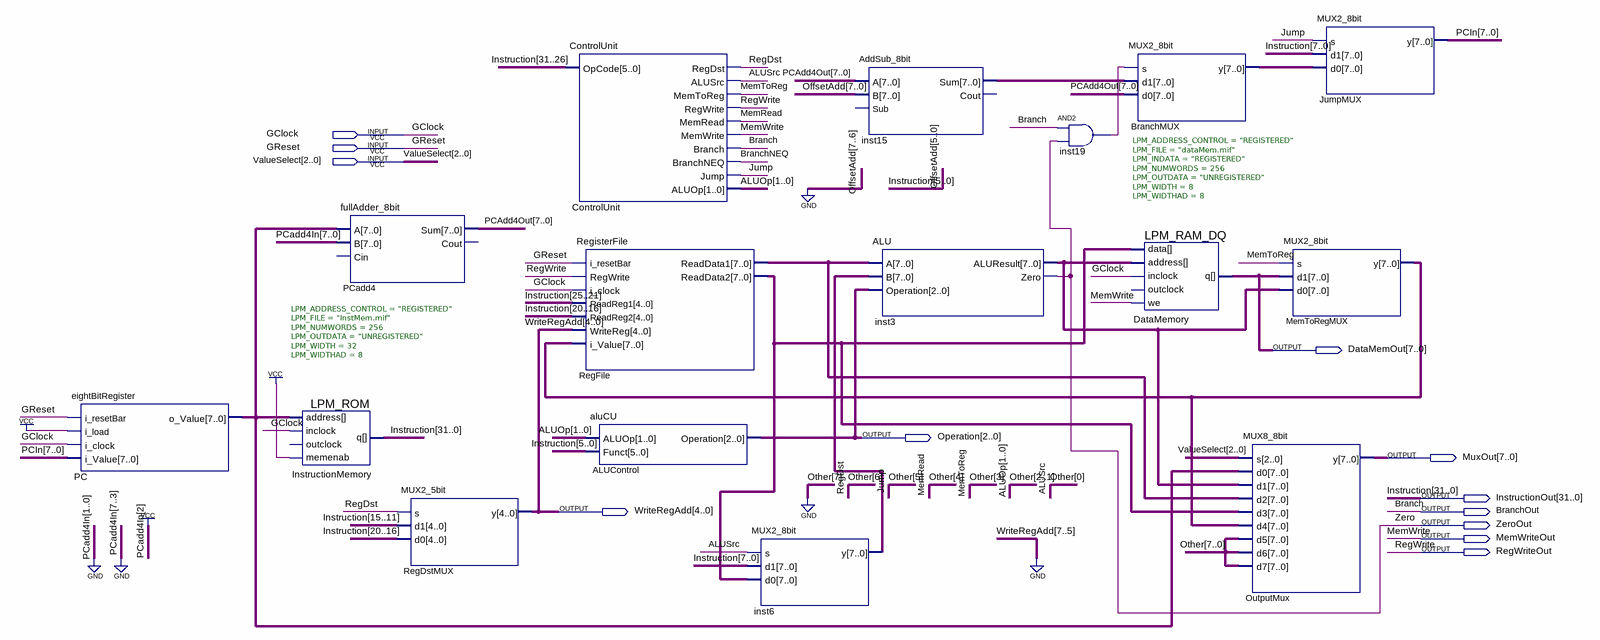
[diagram p0: schematic sheet]
// Quartus schematic singleCycleProc.bdf as structural Verilog: 16 symbols, 12 pins
module singleCycleProc (
  input  GClock,
  input  GReset,
  input  [2:0] ValueSelect,
  output [7:0] DataMemOut,
  output [2:0] Operation,
  output [7:0] MuxOut,
  output [31:0] InstructionOut,
  output [4:0] WriteRegAdd,
  output BranchOut,
  output ZeroOut,
  output MemWriteOut,
  output RegWriteOut
);

  wire ALUSrc, BranchNEQ, inst19_out, Jump, MemRead, MemToReg, RegDst;
  wire [1:0] ALUOp;
  wire [5:0] OffsetAdd;
  wire [6:0] Other;
  wire [7:0] BranchMUX_y, inst3_aluresult, inst6_y, inst15_sum, MemToRegMUX_y, PC_o_value, PCAdd4Out, PCIn,
       RegFile_readdata1, RegFile_readdata2;

  eightBitRegister PC (.i_resetBar(GReset), .i_load(1'b1), .i_clock(GClock), .i_Value(PCIn), .o_Value(PC_o_value));
  fullAdder_8bit PCadd4 (.A(PC_o_value), .B(8'b00000100), .Sum(PCAdd4Out));  // open: Cin, Cout
  LPM_ROM #(.LPM_ADDRESS_CONTROL("REGISTERED"), .LPM_FILE("InstMem.mif"), .LPM_NUMWORDS(256), .LPM_OUTDATA("UNREGISTERED"), .LPM_WIDTH(32), .LPM_WIDTHAD(8)) InstructionMemory (
    .address(PC_o_value), .inclock(GClock), .memenab(1'b1), .q(InstructionOut));  // open: outclock
  MUX2_5bit RegDstMUX (.s(RegDst), .d1(InstructionOut[15:11]), .d0(InstructionOut[20:16]), .y(WriteRegAdd));
  ControlUnit ControlUnit (
    .OpCode(InstructionOut[31:26]), .RegDst(RegDst), .ALUSrc(ALUSrc), .MemToReg(MemToReg),
    .RegWrite(RegWriteOut), .MemRead(MemRead), .MemWrite(MemWriteOut), .Branch(BranchOut),
    .BranchNEQ(BranchNEQ), .Jump(Jump), .ALUOp(ALUOp));
  RegisterFile RegFile (
    .i_resetBar(GReset), .RegWrite(RegWriteOut), .i_clock(GClock), .ReadReg1(InstructionOut[25:21]),
    .ReadReg2(InstructionOut[20:16]), .WriteReg(WriteRegAdd), .i_Value(MemToRegMUX_y),
    .ReadData1(RegFile_readdata1), .ReadData2(RegFile_readdata2));
  aluCU ALUControl (.ALUOp(ALUOp), .Funct(InstructionOut[5:0]), .Operation(Operation));
  MUX2_8bit inst6 (.s(ALUSrc), .d1(InstructionOut[7:0]), .d0(RegFile_readdata2), .y(inst6_y));
  AddSub_8bit inst15 (.A(PCAdd4Out), .B({2'b00, OffsetAdd}), .Sum(inst15_sum));  // open: Sub, Cout
  ALU inst3 (.A(RegFile_readdata1), .B(inst6_y), .Operation(Operation), .ALUResult(inst3_aluresult), .Zero(ZeroOut));
  and inst19 (inst19_out, BranchOut, ZeroOut);
  MUX2_8bit BranchMUX (.s(inst19_out), .d1(inst15_sum), .d0(PCAdd4Out), .y(BranchMUX_y));
  LPM_RAM_DQ #(.LPM_ADDRESS_CONTROL("REGISTERED"), .LPM_FILE("dataMem.mif"), .LPM_INDATA("REGISTERED"), .LPM_NUMWORDS(256), .LPM_OUTDATA("UNREGISTERED"), .LPM_WIDTH(8), .LPM_WIDTHAD(8)) DataMemory (
    .inclock(GClock), .data(RegFile_readdata2), .address(inst3_aluresult), .we(MemWriteOut), .q(DataMemOut));  // open: outclock
  MUX8_8bit OutputMux (
    .s(ValueSelect), .d0(PC_o_value), .d1(inst3_aluresult), .d2(RegFile_readdata1), .d3(RegFile_readdata2),
    .d4(MemToRegMUX_y), .d5({1'b0, Other}), .d6({1'b0, Other}), .d7({1'b0, Other}), .y(MuxOut));
  MUX2_8bit MemToRegMUX (.s(MemToReg), .d1(DataMemOut), .d0(inst3_aluresult), .y(MemToRegMUX_y));
  MUX2_8bit JumpMUX (.s(Jump), .d1(InstructionOut[7:0]), .d0(BranchMUX_y), .y(PCIn));

  // Other names for the same wires on the sheet: Branch = BranchOut; Instruction[31:0] = InstructionOut;
  //   MemWrite = MemWriteOut; RegWrite = RegWriteOut; Zero = ZeroOut
endmodule
